# Altium schematic sheet SERIAL_IF.SchDoc: {Наименование}
size 420 x 297 mm; ApprovedBy: {Утвердил}; CheckedBy: {Проверил}; DrawnBy: {Разраб.}; SheetNumber: 4; Scale: {Мш.}; PageSetup: Record=PageOptions|CenterHorizontal=False|CenterVertical=False|PrintScale=0.95|XCorrection=0.00|YCorrection=0.00|PrintKind=1|BorderSize=5000000|LeftOffset=0|BottomOffset=0|Orientation=1|PaperLength=1000|PaperWidth=1000|Scale=100|PaperSource=15|PrintQuality=600|MediaType=1|DitherType=10|PaperKind=A4|PrintScaleMode=1; ProcessInspection: {Т.контр.}; Mass: {М.}; NormInspection: {Н.контр.}; Letter1Column: {}; Letter2Column: {}; Letter3Column: {}; DocumentType: {Документ}; Rule: PcbType=ProtelPcb
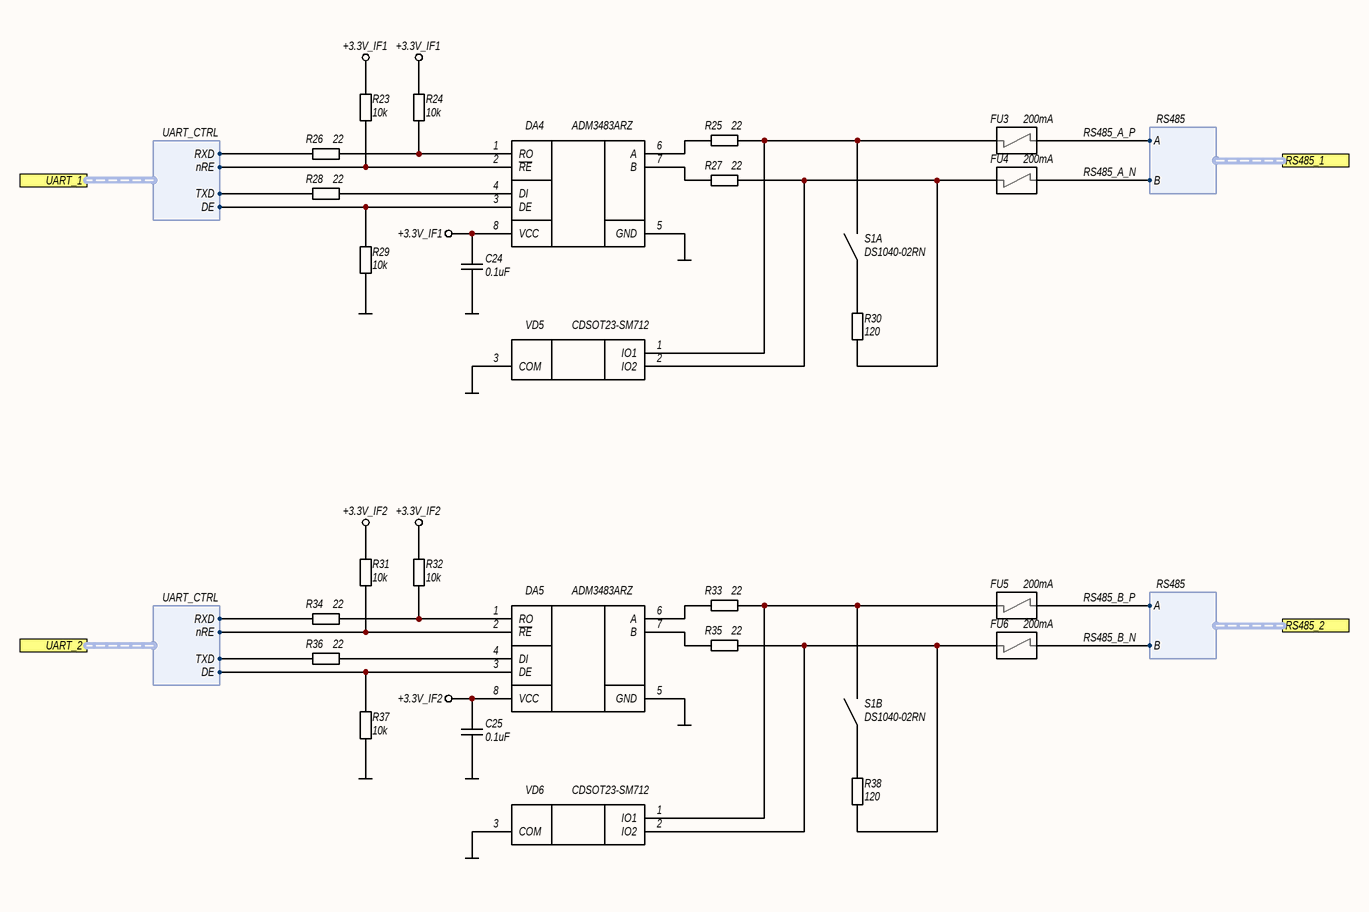
[diagram p0: SERIAL_IF.SchDoc]

## Parts
C24  0.1uF  [C0603N]
C25  0.1uF  [C0603N]
DA4  ADM3483ARZ  [SOIC8]
DA5  ADM3483ARZ  [SOIC8]
FU3  200mA  [TBU-CA]
FU4  200mA  [TBU-CA]
FU5  200mA  [TBU-CA]
FU6  200mA  [TBU-CA]
R23  10k  [R0603N]
R24  10k  [R0603N]
R25  22  [R0805N]
R26  22  [R0603N]
R27  22  [R0805N]
R28  22  [R0603N]
R29  10k  [R0603N]
R30  120  [R1206N]
R31  10k  [R0603N]
R32  10k  [R0603N]
R33  22  [R0805N]
R34  22  [R0603N]
R35  22  [R0805N]
R36  22  [R0603N]
R37  10k  [R0603N]
R38  120  [R1206N]
S1  DS1040-02RN  [DIP_SWITCH_02P_STR_RA_TH]  (parts A,B of 2)
VD5  CDSOT23-SM712  [SOT23]
VD6  CDSOT23-SM712  [SOT23]

## Ports
RS485_1 (harness RS485), RS485_2 (harness RS485), UART_1 (harness UART_CTRL), UART_2 (harness UART_CTRL)

## Harnesses
UART_CTRL: RXD, nRE, TXD, DE
RS485: A, B

## Nets
+3.3V_IF1: C24.1 DA4.8(VCC) R23.1 R24.1
+3.3V_IF2: C25.1 DA5.8(VCC) R31.1 R32.1
GND: C24.2 C25.2 DA4.5(GND) DA5.5(GND) R29.2 R37.2 VD5.3(COM) VD6.3(COM)
RS485_A_N: FU4.3(IN/OUT) ; port RS485_1.B
RS485_A_P: FU3.3(IN/OUT) ; port RS485_1.A
RS485_B_N: FU6.3(IN/OUT) ; port RS485_2.B
RS485_B_P: FU5.3(IN/OUT) ; port RS485_2.A
NetDA4_1: DA4.1(RO) R24.2 R26.1
NetDA4_2: DA4.2(~{RE}) R23.2 ; port UART_1.nRE
NetDA4_3: DA4.3(DE) R29.1 ; port UART_1.DE
NetDA4_4: DA4.4(DI) R28.1
NetDA4_6: DA4.6(A) R25.2
NetDA4_7: DA4.7(B) R27.2
NetDA5_1: DA5.1(RO) R32.2 R34.1
NetDA5_2: DA5.2(~{RE}) R31.2 ; port UART_2.nRE
NetDA5_3: DA5.3(DE) R37.1 ; port UART_2.DE
NetDA5_4: DA5.4(DI) R36.1
NetDA5_6: DA5.6(A) R33.2
NetDA5_7: DA5.7(B) R35.2
NetFU3_1: FU3.1(IN/OUT) R25.1 S1.4 VD5.1(IO1)
NetFU4_1: FU4.1(IN/OUT) R27.1 R30.2 VD5.2(IO2)
NetFU5_1: FU5.1(IN/OUT) R33.1 S1.3 VD6.1(IO1)
NetFU6_1: FU6.1(IN/OUT) R35.1 R38.2 VD6.2(IO2)
NetR26_2: R26.2 ; port UART_1.RXD
NetR28_2: R28.2 ; port UART_1.TXD
NetR30_1: R30.1 S1.1
NetR34_2: R34.2 ; port UART_2.RXD
NetR36_2: R36.2 ; port UART_2.TXD
NetR38_1: R38.1 S1.2

## Notes on the sheet
- Перв. примен.
- Справ. №
- Подп. и дата
- Инв. № дубл.
- Взам. инв. №
- Изм.
- Лист
- № докум.
- Подп.
- Дата
- Т.контр.
- Пров.
- Разраб.
- Лит.
- Листов
- Инв. № подл.
- Н.контр.
- Утв.
- Копировал
- Формат А3

## Library data of the parts
C24 C25 = CL10B104KB8NNNC: Конденсатор; Точность: 10%; Напряжение: 50V; Диэлектрик: X7R; Производитель: Samsung Electro-Mechanics; Описание: 0.1 µF ±10% 50V Ceramic Capacitor X7R 0603 (1608 Metric); Корпус: 0603 (1608 Metric); Температурный диапазон: -55°C ~ 125°C; Вид монтажа: SMD; Артикул: CL10B104KB8NNNC; Номинал: 0.1uF; Строка для документации: https://mm.digikey.com/Volume0/opasdata/d220001/medias/docus/609/CL10B104KB8NNNC_Spec.pdf; Тип элемента: Конденсатор
DA4 DA5 = ADM3483ARZ: Микросхема приемопередатчика RS-485; Производитель: Analog Devices Inc.; Описание: 1/1 Transceiver Half RS422, RS485 8-SOIC; Корпус: 8-SOIC (0.154", 3.90mm Width); Температурный диапазон: -40°C ~ 85°C; Вид монтажа: SMD; Артикул: ADM3483ARZ; Строка для документации: https://www.analog.com/media/en/technical-documentation/data-sheets/ADM3483_3485_3488_3490_3491.pdf; Тип элемента: Микросхема
FU3-FU6 = TBU-CA065-200-WH: Полупроводниковый предохранитель; Напряжение ограничения: 650V; Тип: Surge Suppression IС; Производитель: Bourns Inc.; Описание: SURGE SUPP TBU 200MA 650VIMP SMD; Корпус: 6.50mm x 4.00mm; Температурный диапазон: -55°C ~ 125°C; Вид монтажа: SMD; Артикул: TBU-CA065-200-WH; Ток: 200mA; Строка для документации: https://www.bourns.com/docs/Product-Datasheets/TBU-CA.pdf; Тип элемента: Предохранитель
R23 R24 R29 R31 R32 R37 = RC0603FR-0710KL: Резистор; Точность: 1%; ТКС: ±100ppm/°C; Напряжение: 75V; Производитель: YAGEO; Описание: 10 kOhms ±1% 0.1W, 1/10W Chip Resistor 0603 (1608 Metric) Moisture Resistant Thick Film; Корпус: 0603 (1608 Metric); Температурный диапазон: -55°C ~ 155°C; Вид монтажа: SMD; Артикул: RC0603FR-0710KL; Номинал: 10k; Строка для документации: https://www.yageo.com/upload/media/product/app/datasheet/rchip/pyu-rc_group_51_rohs_l.pdf; Тип элемента: Резистор
R25 R27 R33 R35 = RC0805FR-0722RL: Резистор; Точность: 1%; ТКС: ±100ppm/°C; Напряжение: 150V; Производитель: YAGEO; Описание: 22 Ohms ±1% 0.125W, 1/8W Chip Resistor 0805 (2012 Metric) Moisture Resistant Thick Film; Корпус: 0805 (2012 Metric); Температурный диапазон: -55°C ~ 155°C; Вид монтажа: SMD; Артикул: RC0805FR-0722RL; Номинал: 22; Строка для документации: https://www.yageo.com/upload/media/product/productsearch/datasheet/rchip/PYu-RC_Group_51_RoHS_L_12.pdf; Тип элемента: Резистор
R26 R28 R34 R36 = RC0603FR-0722RL: Резистор; Точность: 1%; ТКС: ±100ppm/°C; Напряжение: 75V; Производитель: YAGEO; Описание: 22 Ohms ±1% 0.1W, 1/10W Chip Resistor 0603 (1608 Metric) Moisture Resistant Thick Film; Корпус: 0603 (1608 Metric); Температурный диапазон: -55°C ~ 155°C; Вид монтажа: SMD; Артикул: RC0603FR-0722RL; Номинал: 22; Строка для документации: https://www.yageo.com/upload/media/product/app/datasheet/rchip/pyu-rc_group_51_rohs_l.pdf; Тип элемента: Резистор
R30 R38 = RC1206FR-07120RL: Резистор; Точность: 1%; ТКС: ±100ppm/°C; Напряжение: 75V; Производитель: YAGEO; Описание: 120 Ohms ±1% 0.25W, 1/4W Chip Resistor 1206 (3216 Metric) Moisture Resistant Thick Film; Корпус: 1206 (3216 Metric); Температурный диапазон: -55°C ~ 155°C; Вид монтажа: SMD; Артикул: RC1206FR-07120RL; Номинал: 120; Строка для документации: https://www.yageo.com/upload/media/product/productsearch/datasheet/rchip/PYu-RC_Group_51_RoHS_L_12.pdf; Тип элемента: Резистор
S1 = DS1040-02RN: Выключатель, DPST-NO; Производитель: Connfly electronic (Zhenqin); Ток: 0.1A; Напряжение: 24V; Описание: Dip Switch SPST 2 Position Through Hole Mount, 2.54mm Spacing, Slide (Standard) Actuator 100mA 24VDC; Вид монтажа: Through hole; Тип элемента: Переключатель; Артикул: DS1040-02RN; Конфигурация контактов: DPST-NO; Строка для документации: https://en.connfly.com/static/upload/file/pdf/DS1040.pdf
VD5 VD6 = CDSOT23-SM712: Сборка TVS диодов; Напряжение: 7.0V; Напряжение ограничения: 14V; Напряжение пробоя: 7.5V; Ток: 17A; Тип: TVS Bidirectional; Производитель: Bourns Inc.; Описание: 26V, 14V Clamp 17A (8/20µs) Ipp Tvs Diode Surface Mount SOT-23-3; Корпус: SOT-23-3; Температурный диапазон: -55°C ~ 150°C (TJ); Тип элемента: Диод защитный; Артикул: CDSOT23-SM712; Строка для документации: https://www.bourns.com/docs/Product-Datasheets/CDSOT23-SM712.pdf